# EasyEDA schematic Sheet_1.json
TITLE: Sheet_1; REV: 1.0; Date: 2023-02-28; Sheet: 1/1; Drawn By: venkatakrishnanr; Company: Your Company
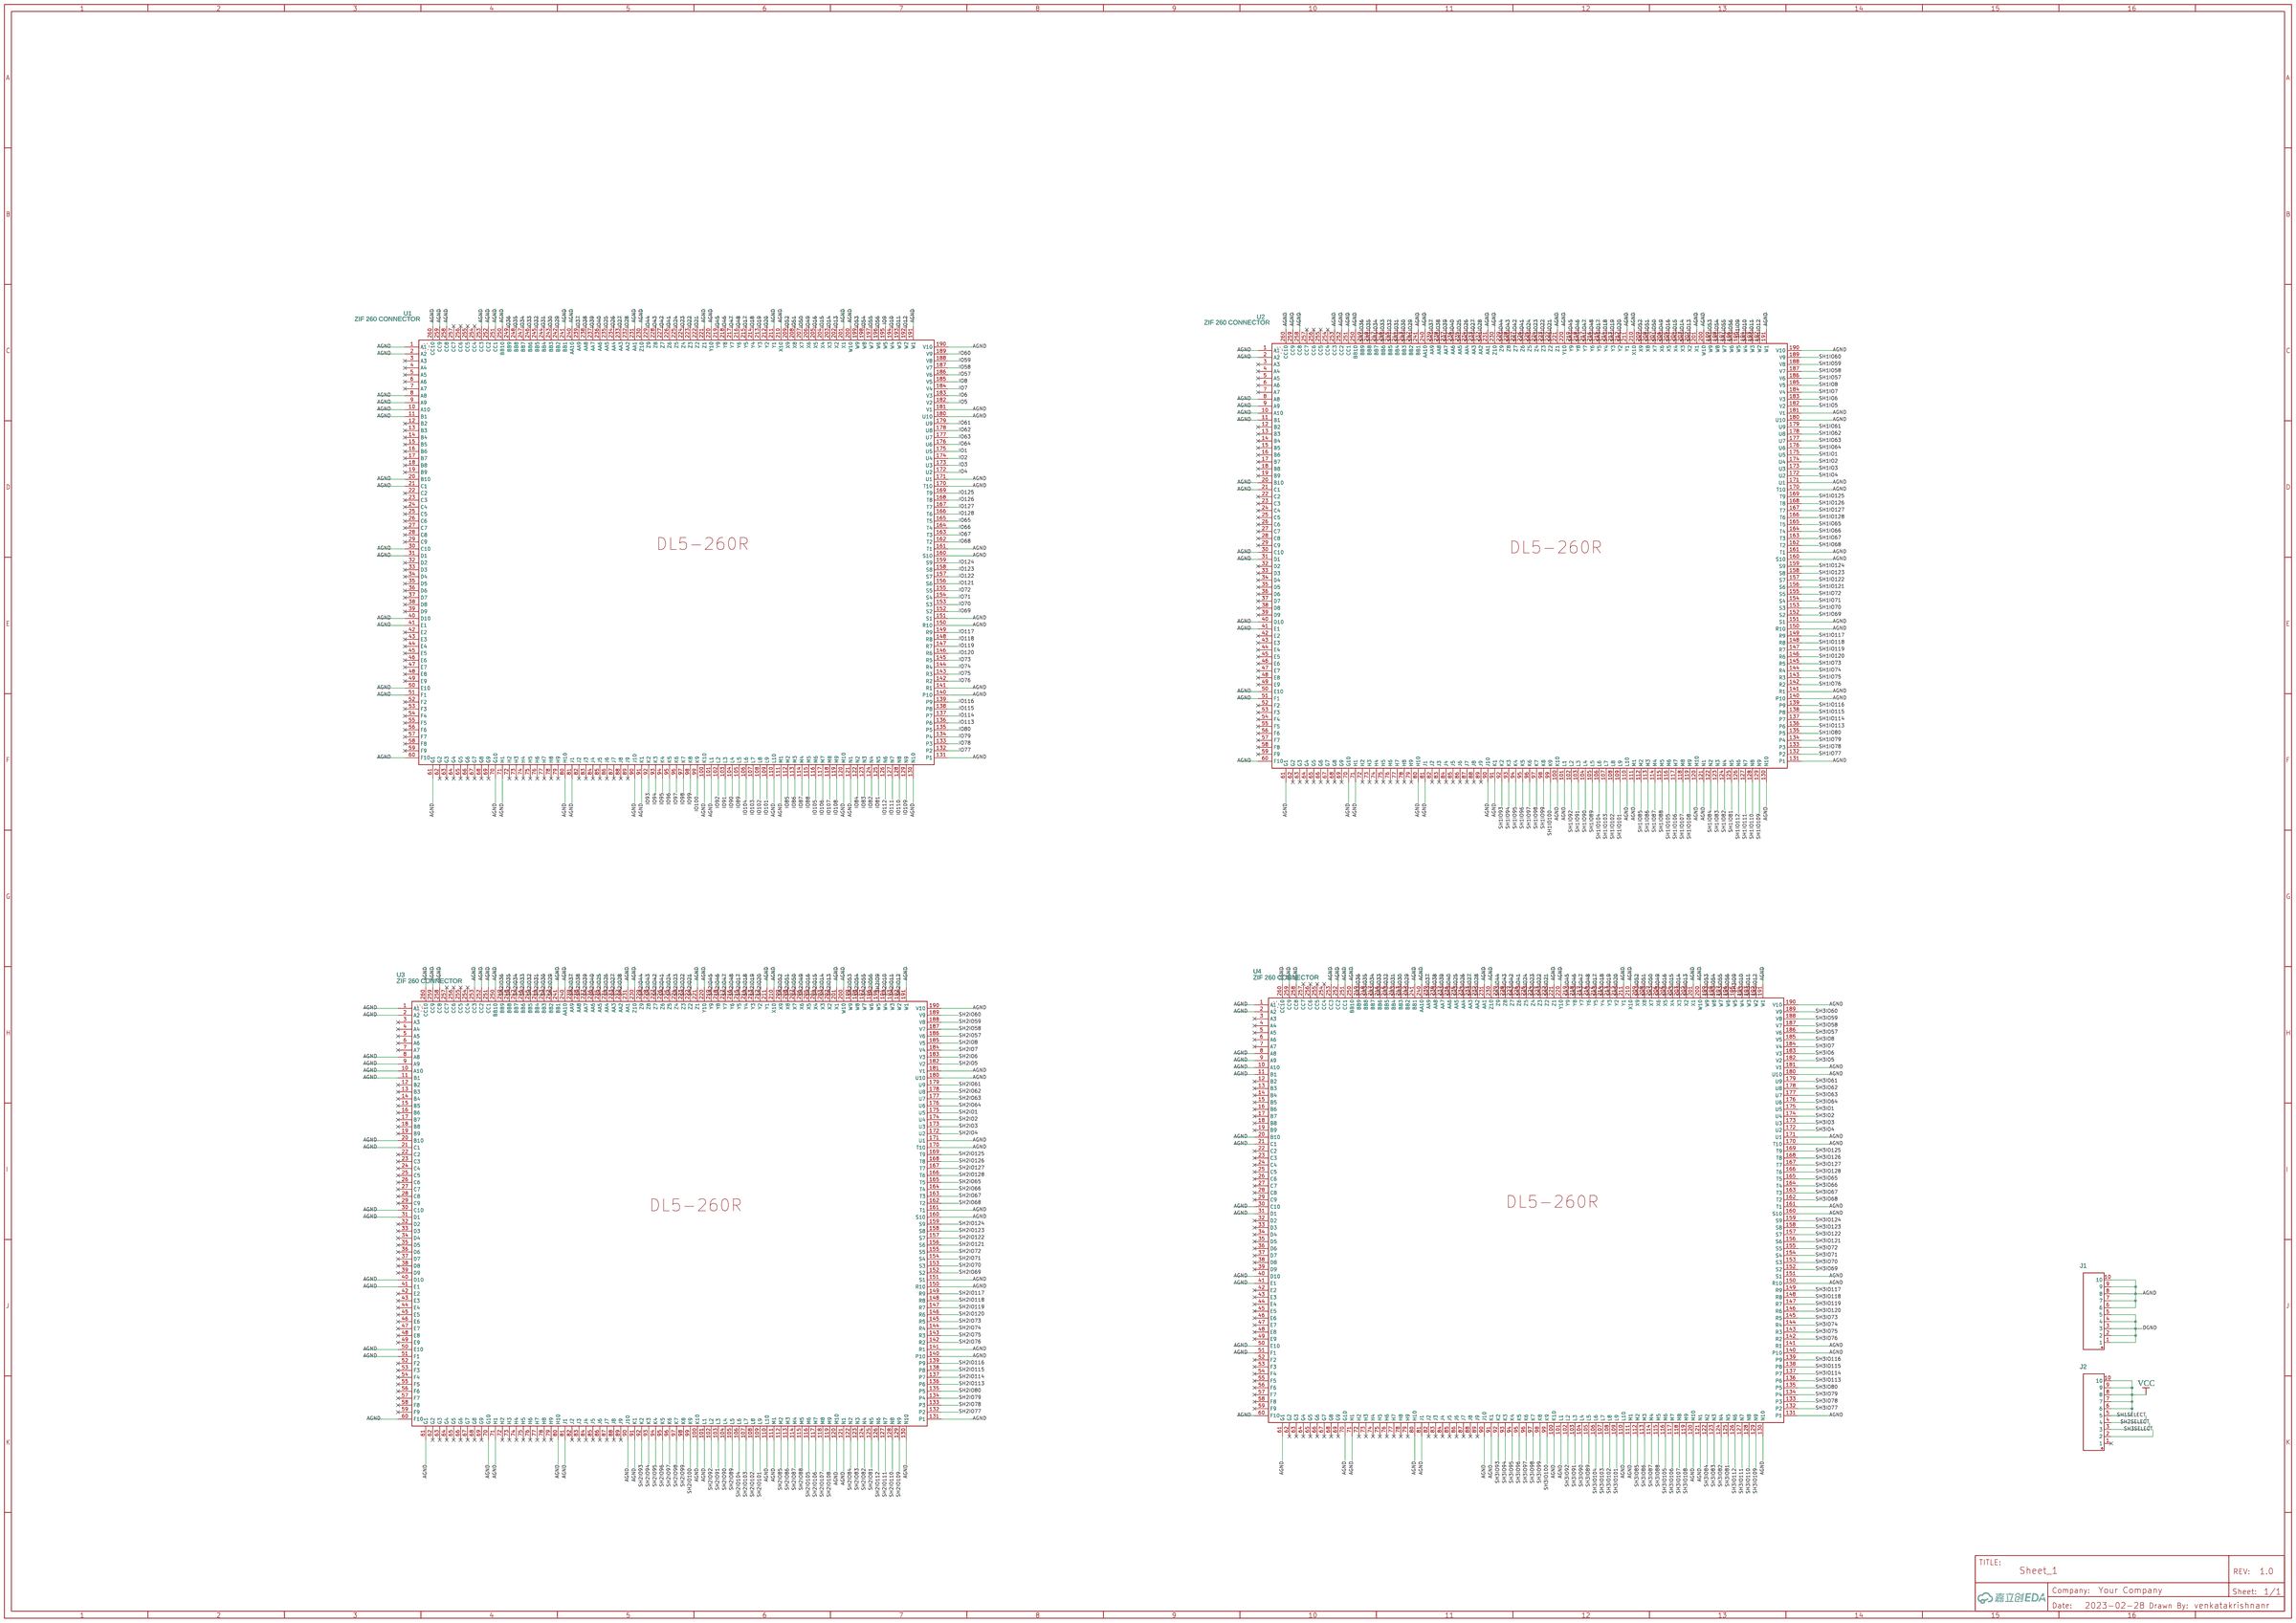
[diagram p0: schematic sheet]

## Parts
J1  210S-1*10P L=11.6MMGold-plated black  [HDR-TH_10P-P2.54-V-M-1]
J2  210S-1*10P L=11.6MMGold-plated black  [HDR-TH_10P-P2.54-V-M-1]
U1  ZIF 260 CONNECTOR  [DL5-260R_M]
U2  ZIF 260 CONNECTOR  [DL5-260R_M]
U3  ZIF 260 CONNECTOR  [DL5-260R_M]
U4  ZIF 260 CONNECTOR  [DL5-260R_M]

## Library data of the parts
J1 J2 = 210S-1*10P L=11.6MMGold-plated black: Supplier: LCSC; Manufacturer: Ckmtw(灿科盟); Manufacturer Part: B-2100S10P-A110; Contributor: LCSC; Supplier Part: C124372; JLCPCB Part Class: Extended Part
U1-U4 = ZIF 26_ CONNECTOR: Manufacturer: ITT Cannon, LLC; Manufacturer Part: DL5-260RW6B; Supplier: Digi-Key; Supplier Part: 1003-1696-ND; link: https://media.digikey.com/pdf/Data%20Sheets/ITT%20Cannon/DL_Series_ZIF_Con_Cat.pdf; Contributor: venkatakrishnanr

## Nets
AGND: J1.6 J1.7 J1.8 J1.9 J1.10 U1.1(A1) U1.2(A2) U1.8(A8) U1.9(A9) U1.10(A10) U1.11(B1) U1.20(B10) U1.21(C1) U1.30(C10) U1.31(D1) U1.40(D10) U1.41(E1) U1.50(E10) U1.51(F1) U1.60(F10) U1.61(G1) U1.70(G10) U1.71(H1) U1.80(H10) U1.81(J1) U1.90(J10) U1.91(K1) U1.100(K10) U1.101(L1) U1.110(L10) U1.111(M1) U1.120(M10) U1.121(N1) U1.130(N10) U1.131(P1) U1.140(P10) U1.141(R1) U1.150(R10) U1.151(S1) U1.160(S10) U1.161(T1) U1.170(T10) U1.171(U1) U1.180(U10) U1.181(V1) U1.190(V10) U1.191(W1) U1.200(W10) U1.201(X1) U1.210(X10) U1.211(Y1) U1.220(Y10) U1.221(Z1) U1.230(Z10) U1.231(AA1) U1.240(AA10) U1.241(BB1) U1.250(BB10) U1.251(CC1) U1.252(CC2) U1.253(CC3) U1.258(CC8) U1.259(CC9) U1.260(CC10) U2.1(A1) U2.2(A2) U2.8(A8) U2.9(A9) U2.10(A10) U2.11(B1) U2.20(B10) U2.21(C1) U2.30(C10) U2.31(D1) U2.40(D10) U2.41(E1) U2.50(E10) U2.51(F1) U2.60(F10) U2.61(G1) U2.70(G10) U2.71(H1) U2.80(H10) U2.81(J1) U2.90(J10) U2.91(K1) U2.100(K10) U2.101(L1) U2.110(L10) U2.111(M1) U2.120(M10) U2.121(N1) U2.130(N10) U2.131(P1) U2.140(P10) U2.141(R1) U2.150(R10) U2.151(S1) U2.160(S10) U2.161(T1) U2.170(T10) U2.171(U1) U2.180(U10) U2.181(V1) U2.190(V10) U2.191(W1) U2.200(W10) U2.201(X1) U2.210(X10) U2.211(Y1) U2.220(Y10) U2.221(Z1) U2.230(Z10) U2.231(AA1) U2.240(AA10) U2.241(BB1) U2.250(BB10) U2.251(CC1) U2.252(CC2) U2.253(CC3) U2.258(CC8) U2.259(CC9) U2.260(CC10) U3.1(A1) U3.2(A2) U3.8(A8) U3.9(A9) U3.10(A10) U3.11(B1) U3.20(B10) U3.21(C1) U3.30(C10) U3.31(D1) U3.40(D10) U3.41(E1) U3.50(E10) U3.51(F1) U3.60(F10) U3.61(G1) U3.70(G10) U3.71(H1) U3.80(H10) U3.81(J1) U3.90(J10) U3.91(K1) U3.100(K10) U3.101(L1) U3.110(L10) U3.111(M1) U3.120(M10) U3.121(N1) U3.130(N10) U3.131(P1) U3.140(P10) U3.141(R1) U3.150(R10) U3.151(S1) U3.160(S10) U3.161(T1) U3.170(T10) U3.171(U1) U3.180(U10) U3.181(V1) U3.190(V10) U3.191(W1) U3.200(W10) U3.201(X1) U3.210(X10) U3.211(Y1) U3.220(Y10) U3.221(Z1) U3.230(Z10) U3.231(AA1) U3.240(AA10) U3.241(BB1) U3.250(BB10) U3.251(CC1) U3.252(CC2) U3.253(CC3) U3.258(CC8) U3.259(CC9) U3.260(CC10) U4.1(A1) U4.2(A2) U4.8(A8) U4.9(A9) U4.10(A10) U4.11(B1) U4.20(B10) U4.21(C1) U4.30(C10) U4.31(D1) U4.40(D10) U4.41(E1) U4.50(E10) U4.51(F1) U4.60(F10) U4.61(G1) U4.70(G10) U4.71(H1) U4.80(H10) U4.81(J1) U4.90(J10) U4.91(K1) U4.100(K10) U4.101(L1) U4.110(L10) U4.111(M1) U4.120(M10) U4.121(N1) U4.130(N10) U4.131(P1) U4.140(P10) U4.141(R1) U4.150(R10) U4.151(S1) U4.160(S10) U4.161(T1) U4.170(T10) U4.171(U1) U4.180(U10) U4.181(V1) U4.190(V10) U4.191(W1) U4.200(W10) U4.201(X1) U4.210(X10) U4.211(Y1) U4.220(Y10) U4.221(Z1) U4.230(Z10) U4.231(AA1) U4.240(AA10) U4.241(BB1) U4.250(BB10) U4.251(CC1) U4.252(CC2) U4.253(CC3) U4.258(CC8) U4.259(CC9) U4.260(CC10)
DGND: J1.1 J1.2 J1.3 J1.4 J1.5
VCC: J2.5 J2.6 J2.7 J2.8 J2.9 J2.10
IO1: U1.175(U5)
IO2: U1.174(U4)
IO3: U1.173(U3)
IO4: U1.172(U2)
IO5: U1.182(V2)
IO6: U1.183(V3)
IO7: U1.184(V4)
IO8: U1.185(V5)
IO9: U1.195(W5)
IO10: U1.194(W4)
IO11: U1.193(W3)
IO12: U1.192(W2)
IO13: U1.202(X2)
IO14: U1.203(X3)
IO15: U1.204(X4)
IO16: U1.205(X5)
IO17: U1.215(Y5)
IO18: U1.214(Y4)
IO19: U1.213(Y3)
IO20: U1.212(Y2)
IO21: U1.222(Z2)
IO22: U1.223(Z3)
IO23: U1.224(Z4)
IO24: U1.225(Z5)
IO25: U1.235(AA5)
IO26: U1.234(AA4)
IO27: U1.233(AA3)
IO28: U1.232(AA2)
IO29: U1.242(BB2)
IO30: U1.243(BB3)
IO31: U1.244(BB4)
IO32: U1.245(BB5)
IO33: U1.246(BB6)
IO34: U1.247(BB7)
IO35: U1.248(BB8)
IO36: U1.249(BB9)
IO37: U1.239(AA9)
IO38: U1.238(AA8)
IO39: U1.237(AA7)
IO40: U1.236(AA6)
IO41: U1.226(Z6)
IO42: U1.227(Z7)
IO43: U1.228(Z8)
IO44: U1.229(Z9)
IO45: U1.219(Y9)
IO46: U1.218(Y8)
IO47: U1.217(Y7)
IO48: U1.216(Y6)
IO49: U1.206(X6)
IO50: U1.207(X7)
IO51: U1.208(X8)
IO52: U1.209(X9)
IO53: U1.199(W9)
IO54: U1.198(W8)
IO55: U1.197(W7)
IO56: U1.196(W6)
IO57: U1.186(V6)
IO58: U1.187(V7)
IO59: U1.188(V8)
IO60: U1.189(V9)
IO61: U1.179(U9)
IO62: U1.178(U8)
IO63: U1.177(U7)
IO64: U1.176(U6)
IO65: U1.165(T5)
IO66: U1.164(T4)
IO67: U1.163(T3)
IO68: U1.162(T2)
IO69: U1.152(S2)
IO70: U1.153(S3)
IO71: U1.154(S4)
IO72: U1.155(S5)
IO73: U1.145(R5)
IO74: U1.144(R4)
IO75: U1.143(R3)
IO76: U1.142(R2)
IO77: U1.132(P2)
IO78: U1.133(P3)
IO79: U1.134(P4)
IO80: U1.135(P5)
IO81: U1.125(N5)
IO82: U1.124(N4)
IO83: U1.123(N3)
IO84: U1.122(N2)
IO85: U1.112(M2)
IO86: U1.113(M3)
IO87: U1.114(M4)
IO88: U1.115(M5)
IO89: U1.105(L5)
IO90: U1.104(L4)
IO91: U1.103(L3)
IO92: U1.102(L2)
IO93: U1.92(K2)
IO94: U1.93(K3)
IO95: U1.94(K4)
IO96: U1.95(K5)
IO97: U1.96(K6)
IO98: U1.97(K7)
IO99: U1.98(K8)
IO100: U1.99(K9)
IO101: U1.109(L9)
IO102: U1.108(L8)
IO103: U1.107(L7)
IO104: U1.106(L6)
IO105: U1.116(M6)
IO106: U1.117(M7)
IO107: U1.118(M8)
IO108: U1.119(M9)
IO109: U1.129(N9)
IO110: U1.128(N8)
IO111: U1.127(N7)
IO112: U1.126(N6)
IO113: U1.136(P6)
IO114: U1.137(P7)
IO115: U1.138(P8)
IO116: U1.139(P9)
IO117: U1.149(R9)
IO118: U1.148(R8)
IO119: U1.147(R7)
IO120: U1.146(R6)
IO121: U1.156(S6)
IO122: U1.157(S7)
IO123: U1.158(S8)
IO124: U1.159(S9)
IO125: U1.169(T9)
IO126: U1.168(T8)
IO127: U1.167(T7)
IO128: U1.166(T6)
SH1IO1: U2.175(U5)
SH1IO2: U2.174(U4)
SH1IO3: U2.173(U3)
SH1IO4: U2.172(U2)
SH1IO5: U2.182(V2)
SH1IO6: U2.183(V3)
SH1IO7: U2.184(V4)
SH1IO8: U2.185(V5)
SH1IO9: U2.195(W5)
SH1IO10: U2.194(W4)
SH1IO11: U2.193(W3)
SH1IO12: U2.192(W2)
SH1IO13: U2.202(X2)
SH1IO14: U2.203(X3)
SH1IO15: U2.204(X4)
SH1IO16: U2.205(X5)
SH1IO17: U2.215(Y5)
SH1IO18: U2.214(Y4)
SH1IO19: U2.213(Y3)
SH1IO20: U2.212(Y2)
SH1IO21: U2.222(Z2)
SH1IO22: U2.223(Z3)
SH1IO23: U2.224(Z4)
SH1IO24: U2.225(Z5)
SH1IO25: U2.235(AA5)
SH1IO26: U2.234(AA4)
SH1IO27: U2.233(AA3)
SH1IO28: U2.232(AA2)
SH1IO29: U2.242(BB2)
SH1IO30: U2.243(BB3)
SH1IO31: U2.244(BB4)
SH1IO32: U2.245(BB5)
SH1IO33: U2.246(BB6)
SH1IO34: U2.247(BB7)
SH1IO35: U2.248(BB8)
SH1IO36: U2.249(BB9)
SH1IO37: U2.239(AA9)
SH1IO38: U2.238(AA8)
SH1IO39: U2.237(AA7)
SH1IO40: U2.236(AA6)
SH1IO41: U2.226(Z6)
SH1IO42: U2.227(Z7)
SH1IO43: U2.228(Z8)
SH1IO44: U2.229(Z9)
SH1IO45: U2.219(Y9)
SH1IO46: U2.218(Y8)
SH1IO47: U2.217(Y7)
SH1IO48: U2.216(Y6)
SH1IO49: U2.206(X6)
SH1IO50: U2.207(X7)
SH1IO51: U2.208(X8)
SH1IO52: U2.209(X9)
SH1IO53: U2.199(W9)
SH1IO54: U2.198(W8)
SH1IO55: U2.197(W7)
SH1IO56: U2.196(W6)
SH1IO57: U2.186(V6)
SH1IO58: U2.187(V7)
SH1IO59: U2.188(V8)
SH1IO60: U2.189(V9)
SH1IO61: U2.179(U9)
SH1IO62: U2.178(U8)
SH1IO63: U2.177(U7)
SH1IO64: U2.176(U6)
SH1IO65: U2.165(T5)
SH1IO66: U2.164(T4)
SH1IO67: U2.163(T3)
SH1IO68: U2.162(T2)
SH1IO69: U2.152(S2)
SH1IO70: U2.153(S3)
SH1IO71: U2.154(S4)
SH1IO72: U2.155(S5)
SH1IO73: U2.145(R5)
SH1IO74: U2.144(R4)
SH1IO75: U2.143(R3)
SH1IO76: U2.142(R2)
SH1IO77: U2.132(P2)
SH1IO78: U2.133(P3)
SH1IO79: U2.134(P4)
SH1IO80: U2.135(P5)
SH1IO81: U2.125(N5)
SH1IO82: U2.124(N4)
SH1IO83: U2.123(N3)
SH1IO84: U2.122(N2)
SH1IO85: U2.112(M2)
SH1IO86: U2.113(M3)
SH1IO87: U2.114(M4)
SH1IO88: U2.115(M5)
SH1IO89: U2.105(L5)
SH1IO90: U2.104(L4)
SH1IO91: U2.103(L3)
SH1IO92: U2.102(L2)
SH1IO93: U2.92(K2)
SH1IO94: U2.93(K3)
SH1IO95: U2.94(K4)
SH1IO96: U2.95(K5)
SH1IO97: U2.96(K6)
SH1IO98: U2.97(K7)
SH1IO99: U2.98(K8)
SH1IO100: U2.99(K9)
SH1IO101: U2.109(L9)
SH1IO102: U2.108(L8)
SH1IO103: U2.107(L7)
SH1IO104: U2.106(L6)
SH1IO105: U2.116(M6)
SH1IO106: U2.117(M7)
SH1IO107: U2.118(M8)
SH1IO108: U2.119(M9)
SH1IO109: U2.129(N9)
SH1IO110: U2.128(N8)
SH1IO111: U2.127(N7)
SH1IO112: U2.126(N6)
SH1IO113: U2.136(P6)
SH1IO114: U2.137(P7)
SH1IO115: U2.138(P8)
SH1IO116: U2.139(P9)
SH1IO117: U2.149(R9)
SH1IO118: U2.148(R8)
SH1IO119: U2.147(R7)
SH1IO120: U2.146(R6)
SH1IO121: U2.156(S6)
SH1IO122: U2.157(S7)
SH1IO123: U2.158(S8)
SH1IO124: U2.159(S9)
SH1IO125: U2.169(T9)
SH1IO126: U2.168(T8)
SH1IO127: U2.167(T7)
SH1IO128: U2.166(T6)
SH1SELECT: J2.4
SH2IO1: U3.175(U5)
SH2IO2: U3.174(U4)
SH2IO3: U3.173(U3)
SH2IO4: U3.172(U2)
SH2IO5: U3.182(V2)
SH2IO6: U3.183(V3)
SH2IO7: U3.184(V4)
SH2IO8: U3.185(V5)
SH2IO9: U3.195(W5)
SH2IO10: U3.194(W4)
SH2IO11: U3.193(W3)
SH2IO12: U3.192(W2)
SH2IO13: U3.202(X2)
SH2IO14: U3.203(X3)
SH2IO15: U3.204(X4)
SH2IO16: U3.205(X5)
SH2IO17: U3.215(Y5)
SH2IO18: U3.214(Y4)
SH2IO19: U3.213(Y3)
SH2IO20: U3.212(Y2)
SH2IO21: U3.222(Z2)
SH2IO22: U3.223(Z3)
SH2IO23: U3.224(Z4)
SH2IO24: U3.225(Z5)
SH2IO25: U3.235(AA5)
SH2IO26: U3.234(AA4)
SH2IO27: U3.233(AA3)
SH2IO28: U3.232(AA2)
SH2IO29: U3.242(BB2)
SH2IO30: U3.243(BB3)
SH2IO31: U3.244(BB4)
SH2IO32: U3.245(BB5)
SH2IO33: U3.246(BB6)
SH2IO34: U3.247(BB7)
SH2IO35: U3.248(BB8)
SH2IO36: U3.249(BB9)
SH2IO37: U3.239(AA9)
SH2IO38: U3.238(AA8)
SH2IO39: U3.237(AA7)
SH2IO40: U3.236(AA6)
SH2IO41: U3.226(Z6)
SH2IO42: U3.227(Z7)
SH2IO43: U3.228(Z8)
SH2IO44: U3.229(Z9)
SH2IO45: U3.219(Y9)
SH2IO46: U3.218(Y8)
SH2IO47: U3.217(Y7)
SH2IO48: U3.216(Y6)
SH2IO49: U3.206(X6)
SH2IO50: U3.207(X7)
SH2IO51: U3.208(X8)
SH2IO52: U3.209(X9)
SH2IO53: U3.199(W9)
SH2IO54: U3.198(W8)
SH2IO55: U3.197(W7)
SH2IO56: U3.196(W6)
SH2IO57: U3.186(V6)
SH2IO58: U3.187(V7)
SH2IO59: U3.188(V8)
SH2IO60: U3.189(V9)
SH2IO61: U3.179(U9)
SH2IO62: U3.178(U8)
SH2IO63: U3.177(U7)
SH2IO64: U3.176(U6)
SH2IO65: U3.165(T5)
SH2IO66: U3.164(T4)
SH2IO67: U3.163(T3)
SH2IO68: U3.162(T2)
SH2IO69: U3.152(S2)
SH2IO70: U3.153(S3)
SH2IO71: U3.154(S4)
SH2IO72: U3.155(S5)
SH2IO73: U3.145(R5)
SH2IO74: U3.144(R4)
SH2IO75: U3.143(R3)
SH2IO76: U3.142(R2)
SH2IO77: U3.132(P2)
SH2IO78: U3.133(P3)
SH2IO79: U3.134(P4)
SH2IO80: U3.135(P5)
SH2IO81: U3.125(N5)
SH2IO82: U3.124(N4)
SH2IO83: U3.123(N3)
SH2IO84: U3.122(N2)
SH2IO85: U3.112(M2)
SH2IO86: U3.113(M3)
SH2IO87: U3.114(M4)
SH2IO88: U3.115(M5)
SH2IO89: U3.105(L5)
SH2IO90: U3.104(L4)
SH2IO91: U3.103(L3)
SH2IO92: U3.102(L2)
SH2IO93: U3.92(K2)
SH2IO94: U3.93(K3)
SH2IO95: U3.94(K4)
SH2IO96: U3.95(K5)
SH2IO97: U3.96(K6)
SH2IO98: U3.97(K7)
SH2IO99: U3.98(K8)
SH2IO100: U3.99(K9)
SH2IO101: U3.109(L9)
SH2IO102: U3.108(L8)
SH2IO103: U3.107(L7)
SH2IO104: U3.106(L6)
SH2IO105: U3.116(M6)
SH2IO106: U3.117(M7)
SH2IO107: U3.118(M8)
SH2IO108: U3.119(M9)
SH2IO109: U3.129(N9)
SH2IO110: U3.128(N8)
SH2IO111: U3.127(N7)
SH2IO112: U3.126(N6)
SH2IO113: U3.136(P6)
SH2IO114: U3.137(P7)
SH2IO115: U3.138(P8)
SH2IO116: U3.139(P9)
SH2IO117: U3.149(R9)
SH2IO118: U3.148(R8)
SH2IO119: U3.147(R7)
SH2IO120: U3.146(R6)
SH2IO121: U3.156(S6)
SH2IO122: U3.157(S7)
SH2IO123: U3.158(S8)
SH2IO124: U3.159(S9)
SH2IO125: U3.169(T9)
SH2IO126: U3.168(T8)
SH2IO127: U3.167(T7)
SH2IO128: U3.166(T6)
SH2SELECT: J2.3
SH3IO1: U4.175(U5)
SH3IO2: U4.174(U4)
SH3IO3: U4.173(U3)
SH3IO4: U4.172(U2)
SH3IO5: U4.182(V2)
SH3IO6: U4.183(V3)
SH3IO7: U4.184(V4)
SH3IO8: U4.185(V5)
SH3IO9: U4.195(W5)
SH3IO10: U4.194(W4)
SH3IO11: U4.193(W3)
SH3IO12: U4.192(W2)
SH3IO13: U4.202(X2)
SH3IO14: U4.203(X3)
SH3IO15: U4.204(X4)
SH3IO16: U4.205(X5)
SH3IO17: U4.215(Y5)
SH3IO18: U4.214(Y4)
SH3IO19: U4.213(Y3)
SH3IO20: U4.212(Y2)
SH3IO21: U4.222(Z2)
SH3IO22: U4.223(Z3)
SH3IO23: U4.224(Z4)
SH3IO24: U4.225(Z5)
SH3IO25: U4.235(AA5)
SH3IO26: U4.234(AA4)
SH3IO27: U4.233(AA3)
SH3IO28: U4.232(AA2)
SH3IO29: U4.242(BB2)
SH3IO30: U4.243(BB3)
SH3IO31: U4.244(BB4)
SH3IO32: U4.245(BB5)
SH3IO33: U4.246(BB6)
SH3IO34: U4.247(BB7)
SH3IO35: U4.248(BB8)
SH3IO36: U4.249(BB9)
SH3IO37: U4.239(AA9)
SH3IO38: U4.238(AA8)
SH3IO39: U4.237(AA7)
SH3IO40: U4.236(AA6)
SH3IO41: U4.226(Z6)
SH3IO42: U4.227(Z7)
SH3IO43: U4.228(Z8)
SH3IO44: U4.229(Z9)
SH3IO45: U4.219(Y9)
SH3IO46: U4.218(Y8)
SH3IO47: U4.217(Y7)
SH3IO48: U4.216(Y6)
SH3IO49: U4.206(X6)
SH3IO50: U4.207(X7)
SH3IO51: U4.208(X8)
SH3IO52: U4.209(X9)
SH3IO53: U4.199(W9)
SH3IO54: U4.198(W8)
SH3IO55: U4.197(W7)
SH3IO56: U4.196(W6)
SH3IO57: U4.186(V6)
SH3IO58: U4.187(V7)
SH3IO59: U4.188(V8)
SH3IO60: U4.189(V9)
SH3IO61: U4.179(U9)
SH3IO62: U4.178(U8)
SH3IO63: U4.177(U7)
SH3IO64: U4.176(U6)
SH3IO65: U4.165(T5)
SH3IO66: U4.164(T4)
SH3IO67: U4.163(T3)
SH3IO68: U4.162(T2)
SH3IO69: U4.152(S2)
SH3IO70: U4.153(S3)
SH3IO71: U4.154(S4)
SH3IO72: U4.155(S5)
SH3IO73: U4.145(R5)
SH3IO74: U4.144(R4)
SH3IO75: U4.143(R3)
SH3IO76: U4.142(R2)
SH3IO77: U4.132(P2)
SH3IO78: U4.133(P3)
SH3IO79: U4.134(P4)
SH3IO80: U4.135(P5)
SH3IO81: U4.125(N5)
SH3IO82: U4.124(N4)
SH3IO83: U4.123(N3)
SH3IO84: U4.122(N2)
SH3IO85: U4.112(M2)
SH3IO86: U4.113(M3)
SH3IO87: U4.114(M4)
SH3IO88: U4.115(M5)
SH3IO89: U4.105(L5)
SH3IO90: U4.104(L4)
SH3IO91: U4.103(L3)
SH3IO92: U4.102(L2)
SH3IO93: U4.92(K2)
SH3IO94: U4.93(K3)
SH3IO95: U4.94(K4)
SH3IO96: U4.95(K5)
SH3IO97: U4.96(K6)
SH3IO98: U4.97(K7)
SH3IO99: U4.98(K8)
SH3IO100: U4.99(K9)
SH3IO101: U4.109(L9)
SH3IO102: U4.108(L8)
SH3IO103: U4.107(L7)
SH3IO104: U4.106(L6)
SH3IO105: U4.116(M6)
SH3IO106: U4.117(M7)
SH3IO107: U4.118(M8)
SH3IO108: U4.119(M9)
SH3IO109: U4.129(N9)
SH3IO110: U4.128(N8)
SH3IO111: U4.127(N7)
SH3IO112: U4.126(N6)
SH3IO113: U4.136(P6)
SH3IO114: U4.137(P7)
SH3IO115: U4.138(P8)
SH3IO116: U4.139(P9)
SH3IO117: U4.149(R9)
SH3IO118: U4.148(R8)
SH3IO119: U4.147(R7)
SH3IO120: U4.146(R6)
SH3IO121: U4.156(S6)
SH3IO122: U4.157(S7)
SH3IO123: U4.158(S8)
SH3IO124: U4.159(S9)
SH3IO125: U4.169(T9)
SH3IO126: U4.168(T8)
SH3IO127: U4.167(T7)
SH3IO128: U4.166(T6)
SH3SELECT: J2.2

Not connected (* = marked no-connect by the designer): J2 1*; U1 3(A3)* 4(A4)* 5(A5)* 6(A6)* 7(A7)* 12(B2)* 13(B3)* 14(B4)* 15(B5)* 16(B6)* 17(B7)* 18(B8)* 19(B9)* 22(C2)* 23(C3)* 24(C4)* 25(C5)* 26(C6)* 27(C7)* 28(C8)* 29(C9)* 32(D2)* 33(D3)* 34(D4)* 35(D5)* 36(D6)* 37(D7)* 38(D8)* 39(D9)* 42(E2)* 43(E3)* 44(E4)* 45(E5)* 46(E6)* 47(E7)* 48(E8)* 49(E9)* 52(F2)* 53(F3)* 54(F4)* 55(F5)* 56(F6)* 57(F7)* 58(F8)* 59(F9)* 62(G2)* 63(G3)* 64(G4)* 65(G5)* 66(G6)* 67(G7)* 68(G8)* 69(G9)* 72(H2)* 73(H3)* 74(H4)* 75(H5)* 76(H6)* 77(H7)* 78(H8)* 79(H9)* 82(J2)* 83(J3)* 84(J4)* 85(J5)* 86(J6)* 87(J7)* 88(J8)* 89(J9)* 254(CC4)* 255(CC5)* 256(CC6)* 257(CC7)*; U2 3(A3)* 4(A4)* 5(A5)* 6(A6)* 7(A7)* 12(B2)* 13(B3)* 14(B4)* 15(B5)* 16(B6)* 17(B7)* 18(B8)* 19(B9)* 22(C2)* 23(C3)* 24(C4)* 25(C5)* 26(C6)* 27(C7)* 28(C8)* 29(C9)* 32(D2)* 33(D3)* 34(D4)* 35(D5)* 36(D6)* 37(D7)* 38(D8)* 39(D9)* 42(E2)* 43(E3)* 44(E4)* 45(E5)* 46(E6)* 47(E7)* 48(E8)* 49(E9)* 52(F2)* 53(F3)* 54(F4)* 55(F5)* 56(F6)* 57(F7)* 58(F8)* 59(F9)* 62(G2)* 63(G3)* 64(G4)* 65(G5)* 66(G6)* 67(G7)* 68(G8)* 69(G9)* 72(H2)* 73(H3)* 74(H4)* 75(H5)* 76(H6)* 77(H7)* 78(H8)* 79(H9)* 82(J2)* 83(J3)* 84(J4)* 85(J5)* 86(J6)* 87(J7)* 88(J8)* 89(J9)* 254(CC4)* 255(CC5)* 256(CC6)* 257(CC7)*; U3 3(A3)* 4(A4)* 5(A5)* 6(A6)* 7(A7)* 12(B2)* 13(B3)* 14(B4)* 15(B5)* 16(B6)* 17(B7)* 18(B8)* 19(B9)* 22(C2)* 23(C3)* 24(C4)* 25(C5)* 26(C6)* 27(C7)* 28(C8)* 29(C9)* 32(D2)* 33(D3)* 34(D4)* 35(D5)* 36(D6)* 37(D7)* 38(D8)* 39(D9)* 42(E2)* 43(E3)* 44(E4)* 45(E5)* 46(E6)* 47(E7)* 48(E8)* 49(E9)* 52(F2)* 53(F3)* 54(F4)* 55(F5)* 56(F6)* 57(F7)* 58(F8)* 59(F9)* 62(G2)* 63(G3)* 64(G4)* 65(G5)* 66(G6)* 67(G7)* 68(G8)* 69(G9)* 72(H2)* 73(H3)* 74(H4)* 75(H5)* 76(H6)* 77(H7)* 78(H8)* 79(H9)* 82(J2)* 83(J3)* 84(J4)* 85(J5)* 86(J6)* 87(J7)* 88(J8)* 89(J9)* 254(CC4)* 255(CC5)* 256(CC6)* 257(CC7)*; U4 3(A3)* 4(A4)* 5(A5)* 6(A6)* 7(A7)* 12(B2)* 13(B3)* 14(B4)* 15(B5)* 16(B6)* 17(B7)* 18(B8)* 19(B9)* 22(C2)* 23(C3)* 24(C4)* 25(C5)* 26(C6)* 27(C7)* 28(C8)* 29(C9)* 32(D2)* 33(D3)* 34(D4)* 35(D5)* 36(D6)* 37(D7)* 38(D8)* 39(D9)* 42(E2)* 43(E3)* 44(E4)* 45(E5)* 46(E6)* 47(E7)* 48(E8)* 49(E9)* 52(F2)* 53(F3)* 54(F4)* 55(F5)* 56(F6)* 57(F7)* 58(F8)* 59(F9)* 62(G2)* 63(G3)* 64(G4)* 65(G5)* 66(G6)* 67(G7)* 68(G8)* 69(G9)* 72(H2)* 73(H3)* 74(H4)* 75(H5)* 76(H6)* 77(H7)* 78(H8)* 79(H9)* 82(J2)* 83(J3)* 84(J4)* 85(J5)* 86(J6)* 87(J7)* 88(J8)* 89(J9)* 254(CC4)* 255(CC5)* 256(CC6)* 257(CC7)*
